# EasyEDA Pro project evenVCO.eprj, board PCB1_2
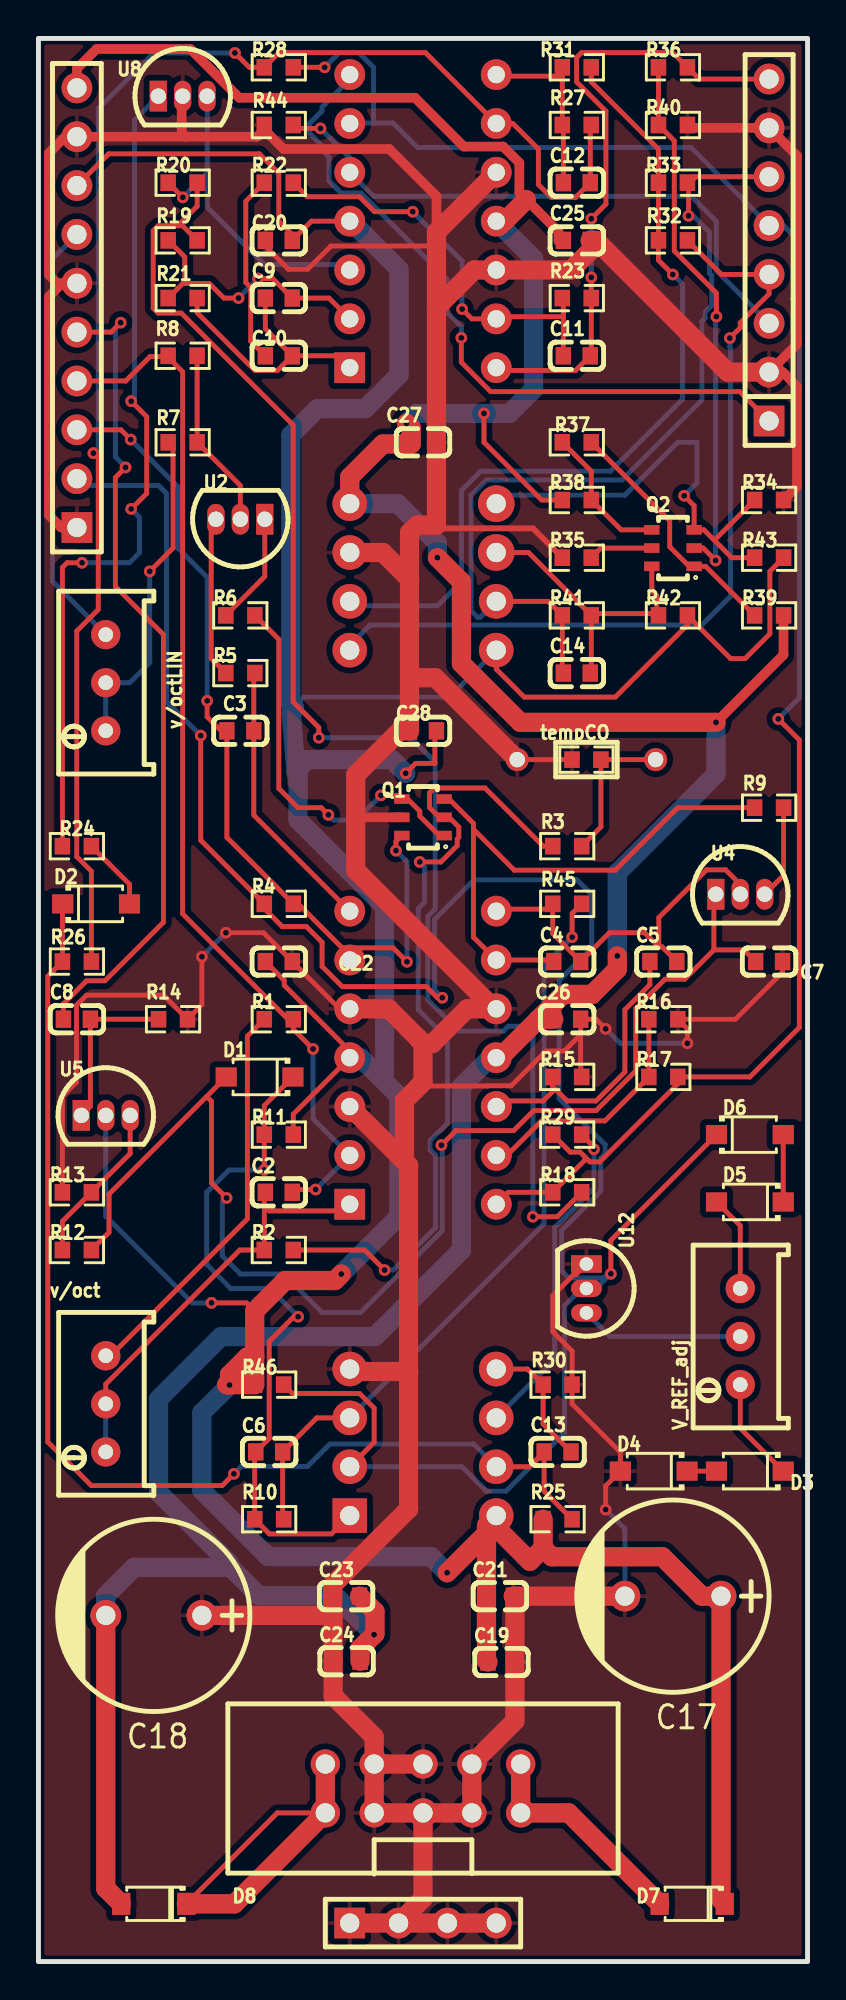
[diagram p4: board, top side]
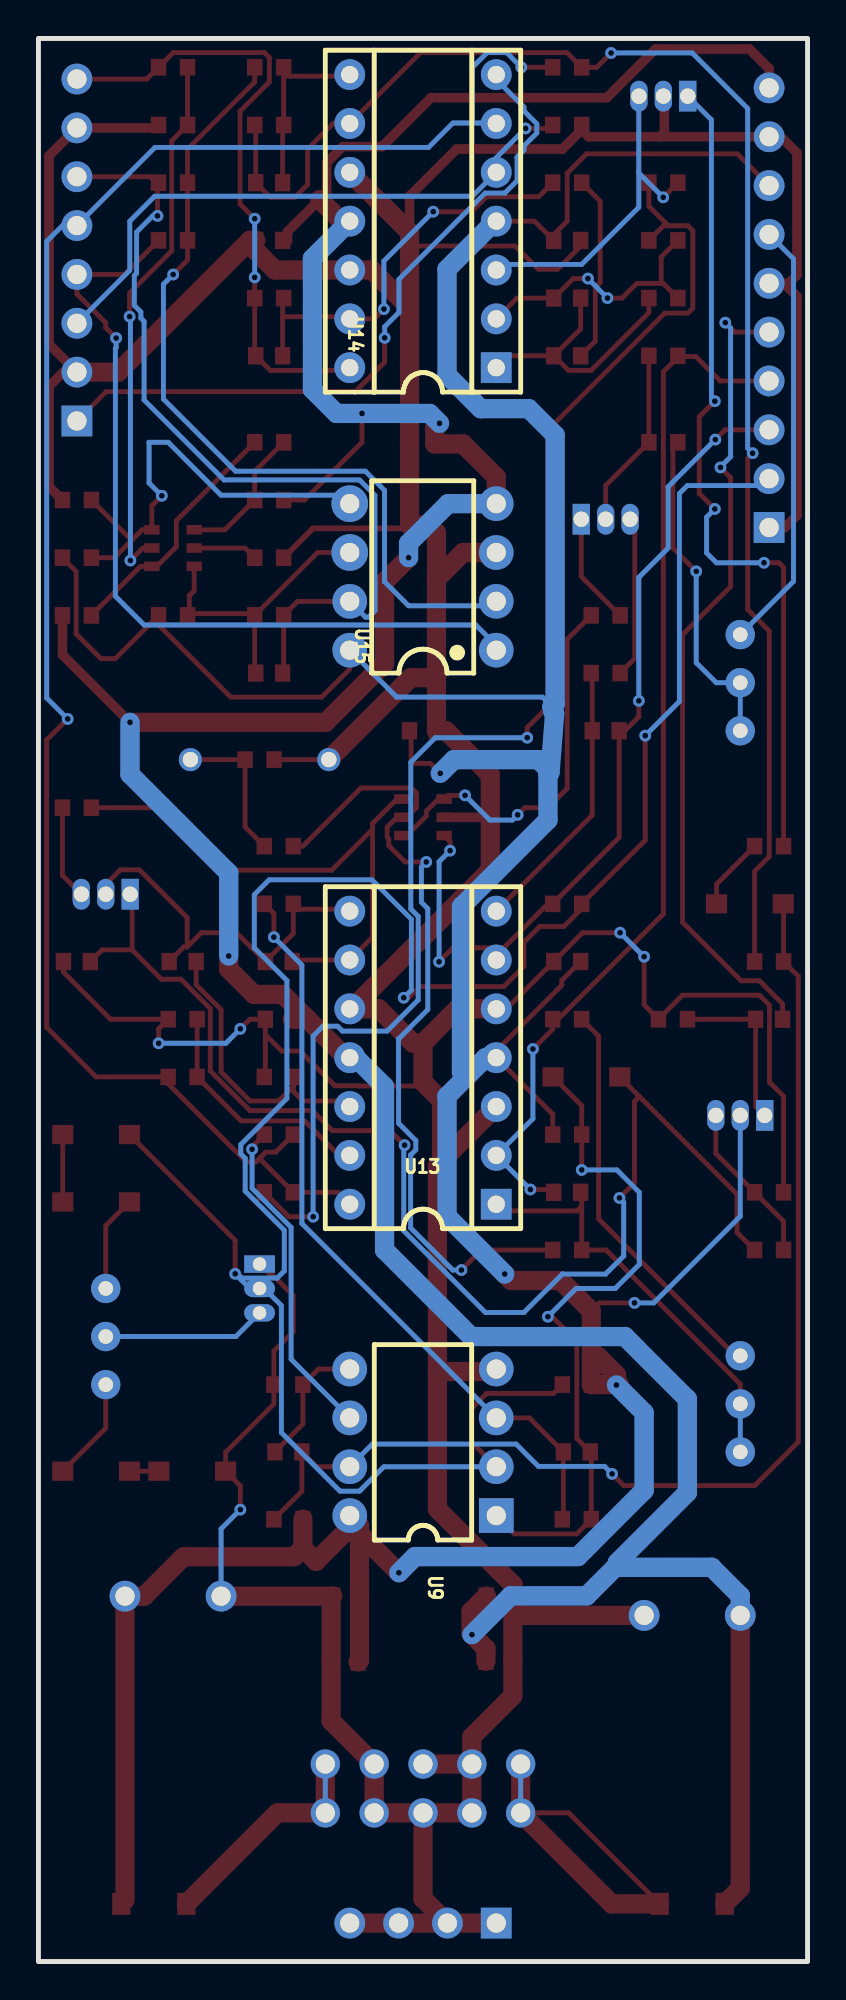
[diagram p5: board, bottom side, seen from below]

Outline 40 x 100 mm; copper layers: Top Layer, Bottom Layer. Coordinates in mm from the lower left corner of the outline.
Outline path: rectangle 0,100 40,0
Stack: Top Layer 0.035mm / Dielectric1 1.51mm FR4 er 4.5 / Bottom Layer 0.035mm

## Design rules (mm)
template: JLCPCB Capability(Two Layers Board)
spacing copperThickness1oz (default): track to track 0.102, other pairs 0.152 to 0.3
spacing copperThickness2oz: track to track 0.203, other pairs 0.152 to 0.3
track width copperThickness1oz (default): min 0.127, default 0.254, max 2.54
track width copperThickness2oz: min 0.203, default 0.254, max 2.54
differential pair differentialPair (default): width min 0.127, default 0.254, max 2.54; gap min 0.152, default 0.152
via viaSize (default): diameter min 0.5, default 0.61, max 10; hole min 0.3, default 0.305, max 6.3

## Placement (name value [footprint] x y rotation side)
C2  10nF  [C0603]  12.5 40 0 top
C3  1nF  [C0603]  10.5 64 180 top
C4  2.2nF styrene  [C0603]  27.5 52 0 top
C5  680nF polyester  [C0603]  32.5 52 0 top
C6  47pF  [C0603]  12 26.5 0 top
C7  47pF  [C0603]  38 52 180 top
C8  1nF  [C0603]  2 49 0 top
C9  3pF  [C0603]  12.5 86.5 180 top
C10  680nF  [C0603]  12.5 83.5 180 top
C11  10pF  [C0603]  28 83.5 0 top
C12  10pF  [C0603]  28 92.5 0 top
C13  10pF  [C0603]  27 26.5 180 top
C14  2.2nF  [C0603]  28 67 0 top
C17  10uF  [CAP-TH_BD10.0-P5.00-D1.0-FD-H16.0]  33 19 180 top
C18  10uF  [CAP-TH_BD10.0-P5.00-D1.0-FD-H16.0]  6 18 180 top
C19  100nF  [C0603]  24.08 15.58 0 top
C20  100nF  [C0603]  12.5 89.5 180 top
C21  100nF  [C0603]  24 19 0 top
C22  100nF  [C0603]  12.5 52 0 top
C23  100nF  [C0603]  16 19 0 top
C24  100nF  [C0603]  16.03 15.62 0 top
C25  100nF  [C0603]  28 89.5 180 top
C26  100nF  [C0603]  27.5 49 180 top
C27  100nF  [C0603]  20 79 180 top
C28  100nF  [C0603]  20 64 180 top
D1  1N4148W  [SOD-123F_L2.7-W1.6-LS3.8-RD]  11.5 46 180 top
D2  1N4148W  [SOD-123F_L2.7-W1.6-LS3.8-RD]  3 55 0 top
D3  1N4148W  [SOD-123F_L2.7-W1.6-LS3.8-RD]  37 25.5 180 top
D4  1N4148W  [SOD-123F_L2.7-W1.6-LS3.8-RD]  32 25.5 180 top
D5  1N4148W  [SOD-123F_L2.7-W1.6-LS3.8-RD]  37 39.5 180 top
D6  1N4148W  [SOD-123F_L2.7-W1.6-LS3.8-RD]  37 43 0 top
D7  1N5817W  [SOD-123_L2.8-W1.8-LS3.7-RD]  34 3 180 top
D8  1N5817W  [SOD-123_L2.8-W1.8-LS3.7-RD]  6 3 180 top
H1  HTSW-110-07-G-S  [HDR-TH_TSW-110-17-F-S-LL]  2 86 90 top
H2  HTSW-108-22-T-S  [HDR-TH_HTSW-108-22-T-S]  38 89 90 top
H3  HTSW-104-18-F-S  [HDR-TH_HTSW-104-25-S-S-LL]  20 2 180 top
P1  power  [IDC-TH_10P-P2.54_C5665]  20 9 0 top
Q1  BCM847DS,115  [SC-74-6_L2.9-W1.5-P0.95-LS2.8-BR]  20 59.5 0 top
Q2  BCM847DS,115  [SC-74-6_L2.9-W1.5-P0.95-LS2.8-BR]  33 73.5 0 top
R1  95.3k  [R0603]  12.5 49 180 top
R2  6.2k  [R0603]  12.5 37 0 top
R3  4.22R  [R0603]  27.5 58 0 top
R4  820k  [R0603]  12.5 55 180 top
R5  1.5k  [R0603]  10.5 67 180 top
R6  1.5k  [R0603]  10.5 70 0 top
R7  510R  [R0603]  7.5 79 0 top
R8  150k  [R0603]  7.5 83.5 180 top
R9  270R  [R0603]  38 60 0 top
R10  330k  [R0603]  12 23 180 top
R11  22k  [R0603]  12.5 43 0 top
R12  22k  [R0603]  2 37 180 top
R13  100k  [R0603]  2 40 0 top
R14  47k  [R0603]  7 49 180 top
R15  2M  [R0603]  27.5 46 0 top
R16  100k  [R0603]  32.5 49 0 top
R17  100k  [R0603]  32.5 46 180 top
R18  10K  [R0603]  27.5 40 180 top
R19  82k  [R0603]  7.5 89.5 0 top
R20  100K  [R0603]  7.5 92.5 0 top
R21  100k  [R0603]  7.5 86.5 0 top
R22  100k  [R0603]  12.5 92.5 180 top
R23  200k  [R0603]  28 86.5 180 top
R24  220k  [R0603]  2 58 180 top
R25  2.2k  [R0603]  27 23 0 top
R26  430k  [R0603]  2 52 0 top
R27  220k  [R0603]  28 95.5 180 top
R28  100k  [R0603]  12.5 98.5 180 top
R29  100k  [R0603]  27.5 43 0 top
R30  100k  [R0603]  27 30 0 top
R31  22k  [R0603]  28 98.5 180 top
R32  10K  [R0603]  33 89.5 0 top
R33  20k  [R0603]  33 92.5 0 top
R34  10K  [R0603]  38 76 180 top
R35  1k  [R0603]  28 73 180 top
R36  22k  [R0603]  33 98.5 0 top
R37  390  [R0603]  28 79 0 top
R38  43k  [R0603]  28 76 0 top
R39  43k  [R0603]  38 70 180 top
R40  1k  [R0603]  33 95.5 180 top
R41  10K  [R0603]  28 70 0 top
R42  10K  [R0603]  33 70 0 top
R43  10K  [R0603]  38 73 180 top
R44  100k  [R0603]  12.5 95.5 0 top
R45  10K  [R0603]  27.5 55 0 top
R46  1k  [R0603]  12 30 180 top
RTemp  10kΩ  [RES-TH_BD1.8-L3.2-P7.20-D0.4]  28.5 62.5 180 top
tempCO  100R_3500ppm  [R0603]  28.5 62.5 180 top
U2  2N3906(ZA)PNP  [TO-92-3_L4.9-W3.7-P1.27-L_RICKY-RS0108S-U]  10.5 75 180 top
U4  2N3904S(ZC)NPN  [TO-92-3_L4.9-W3.7-P1.27-L_RICKY-RS0108S-U]  36.5 55.5 0 top
U5  2N3904S(ZC)NPN  [TO-92-3_L4.9-W3.7-P1.27-L_RICKY-RS0108S-U]  3.5 44 0 top
U8  2N3904S(ZC)NPN  [TO-92-3_L4.9-W3.7-P1.27-L_RICKY-RS0108S-U]  7.5 97 0 top
U9  LM393N  [DIP-8_L9.7-W6.4-P2.54-LS7.6-BL]  20 27 90 bottom
U12  LM336  [TO-92-3_L4.9-W3.7-P1.27-L]  28.5 35 270 top
U13  TL084CN  [DIP-14_L17.8-W10.2-P2.54-BL_3]  20 47 90 bottom
U14  TL084CN  [DIP-14_L17.8-W10.2-P2.54-BL_3]  20 90.5 90 bottom
U15  TL082  [PDIP-8_L9.6-W6.4-P2.54-LS7.6-BL]  20 72 90 bottom
v/oct  10kΩ  [RES-ADJ-TH_3P-L10.0-W10.0-P2.50-L]  3.5 29 90 top
v/octLIN  1kΩ  [RES-ADJ-TH_3P-L10.0-W10.0-P2.50-L]  3.5 66.5 90 top
V_REF_adj  10kΩ  [RES-ADJ-TH_3P-L10.0-W10.0-P2.50-L]  36.5 32.5 90 top

## Footprints (pads in the part's own frame, mm; a bottom-side part is the same pattern mirrored in y, then rotated)
C0603
  rect 0.8x0.9 smd: 1(-0.7,0) 2(0.7,0)
CAP-TH_BD10.0-P5.00-D1.0-FD-H16.0
  round 1.6 hole 1: 1(-2.5,0) 2(2.5,0)
DIP-8_L9.7-W6.4-P2.54-LS7.6-BL
  rect 1.8x1.8 hole 1: 1(-3.81,-3.81)
  round 1.8 hole 1: 2(-1.27,-3.81) 3(1.27,-3.81) 4(3.81,-3.81) 5(3.81,3.81) 6(1.27,3.81) 7(-1.27,3.81) 8(-3.81,3.81)
DIP-14_L17.8-W10.2-P2.54-BL_3
  rect 1.6x1.6 hole 0.9: 1(-7.62,-3.81)
  round 1.6 hole 0.9: 2(-5.08,-3.81) 3(-2.54,-3.81) 4(0,-3.81) 5(2.54,-3.81) 6(5.08,-3.81) 7(7.62,-3.81) 8(7.62,3.81) 9(5.08,3.81) 10(2.54,3.81) 11(0,3.81) 12(-2.54,3.81) 13(-5.08,3.81) 14(-7.62,3.81)
HDR-TH_HTSW-104-25-S-S-LL
  rect 1.6x1.6 hole 1: 1(3.81,0)
  round 1.6 hole 1: 2(1.27,0) 3(-1.27,0) 4(-3.81,0)
HDR-TH_HTSW-108-22-T-S
  rect 1.6x1.6 hole 1: 1(-8.89,0)
  round 1.6 hole 1: 2(-6.35,0) 3(-3.81,0) 4(-1.27,0) 5(1.27,0) 6(3.81,0) 7(6.35,0) 8(8.89,0)
HDR-TH_TSW-110-17-F-S-LL
  rect 1.6x1.6 hole 1: 1(-11.43,0)
  round 1.6 hole 1: 2(-8.89,0) 3(-6.35,0) 4(-3.81,0) 5(-1.27,0) 6(1.27,0) 7(3.81,0) 8(6.35,0) 9(8.89,0) 10(11.43,0)
IDC-TH_10P-P2.54_C5665
  round 1.524 hole 1: 1(-5.08,-1.27) 2(-5.08,1.27) 3(-2.54,-1.27) 4(-2.54,1.27) 5(0,-1.27) 6(0,1.27) 7(2.54,-1.27) 8(2.54,1.27) 9(5.08,-1.27) 10(5.08,1.27)
PDIP-8_L9.6-W6.4-P2.54-LS7.6-BL
  round 1.8 hole 1: 1(-3.81,-3.81) 2(-1.27,-3.81) 3(1.27,-3.81) 4(3.81,-3.81) 7(-1.27,3.81) 8(-3.81,3.81)
  round 1.905 hole 1: 5(3.81,3.81) 6(1.27,3.81)
R0603
  rect 0.806x0.864 smd: 1(-0.753,0) 2(0.753,0)
RES-ADJ-TH_3P-L10.0-W10.0-P2.50-L
  round 1.524 hole 0.762: 1(-2.5,0) 2(0,0) 3(2.5,0)
RES-TH_BD1.8-L3.2-P7.20-D0.4
  round 1.2 hole 0.8: 1(-3.6,0) 2(3.6,0)
SC-74-6_L2.9-W1.5-P0.95-LS2.8-BR
  rect 0.8x0.5 smd: 1(1.1,-0.95) 2(1.1,0) 3(1.1,0.95) 4(-1.1,0.95) 5(-1.1,0) 6(-1.1,-0.95)
SOD-123_L2.8-W1.8-LS3.7-RD
  rect 0.95x1.15 smd: 1(-1.692,0) 2(1.692,0)
SOD-123F_L2.7-W1.6-LS3.8-RD
  rect 1.1x1 smd: 1(-1.735,0) 2(1.735,0)
TO-92-3_L4.9-W3.7-P1.27-L
  rect 0.9x1.6 hole 0.7: 1(-1.27,0)
  oval 0.9x1.6 hole 0.7: 2(0,0) 3(1.27,0)
TO-92-3_L4.9-W3.7-P1.27-L_RICKY-RS0108S-U
  rect 0.9x1.6 hole 0.8: 1(-1.27,0)
  oval 0.9x1.6 hole 0.8: 2(1.27,0) 3(0,0)

## Nets
As in the schematic.

## Via types
v1: diameter 0.61, hole 0.305, Top Layer to Bottom Layer, 63 vias

## Routing (per net, layer and track width the routed paths; a pad name or vN(x,y) marks a point on that pad's centre or on a via; arc(x,y) is an arc through that point)
+12V: length 233.4
  Top Layer w0.254: 11.25,33.82 10.82,34.25 v1(9,34.25) ; C22.1 12.78,51.02 12.78,50.76 16.19,47.36 U13.4 13.25,44.06 R11.2 ; U9.8 23.3,22.68 ; U14.4 14.2,90.5 C20.1 13.2,89.8 12.5,90.5 12.5,92.99 11.49,94 3.65,94 H1.8 ; v1(19.1,61.79) 19.62,62.3 20.62,62.3 20.62,63.92 C28.1 ; R43.1 38.04,72.29 38.04,69.04 36.75,67.75 36,67.75 R42.2 33.75,69.5 30,65.75 25.27,65.75 23.81,67.21 U15.8 ; 35.5,3.19 D7.1
  Top Layer w1: 11.25,31.45 11.25,33.82 12.84,35.41 15.41,35.41 v1(15.75,35.75) ; 11.25,31.45 R46.2 9.94,30 ; 11.25,31.45 10.88,31.45 9.94,30.51 9.94,30.14 ; 9.94,30 9.8,30 9.94,30.14 ; 9.94,30 v1(9.94,29.98) ; 9.94,30 9.94,30.14 ; C19.1 23.3,15.66 C21.1 ; 26.25,21.5 26.7,21.05 32.45,21.05 34.5,19 C17.1 35.5,3.19 ; 26.25,21.5 26.25,21.5 25.56,20.81 23.81,22.56 U9.8 ; 26.25,21.5 R25.1 ; 23.3,22.27 23.3,19 ; 23.3,22.27 v1(21.25,20.22) ; 23.3,22.27 23.3,22.68
  Bottom Layer w0.254: v1(9,34.25) 8,34.25 3.5,38.75 U5.3 ; U15.8 21.37,65.75 13.79,65.75 13.29,65.25 13.25,65.25 13.24,65.24 ; 13.23,65.17 13.06,65 13.24,65 13.24,65.19
  Bottom Layer w1: 17.75,46 18,46.25 18,54.86 13.5,59.36 13.5,61.75 ; 17.75,46 16.75,47 U13.4 ; 17.75,46 18.75,45 18.75,38.75 v1(15.75,35.75) ; v1(21.25,20.22) 20.41,21.06 11.94,21.06 8.5,24.5 8.5,28.54 v1(9.94,29.98) ; 13.5,61.75 13.39,61.84 13.15,64.89 13.24,65 13.23,65.17 13.24,65.19 13.29,65.24 13.29,65.25 13.13,65.39 13.13,79.38 14.5,80.75 17,80.75 18.75,82.5 18.75,88 16.25,90.5 U14.4 ; 13.5,61.75 13.5,62 14,62.5 18.39,62.5 v1(19.1,61.79)
-12V: length 198.6
  Top Layer w0.254: R38.1 26.17,76 23.17,79 v1(23.17,80.5) ; 19.39,78.91 C27.2 ; C25.2 27.05,89.45
  Top Layer w0.5: R39.1 38.75,70 38.75,67.95 v1(35.24,64.44) ; H1.10 2,98.43 3.02,99.45 7.91,99.45 10.44,96.92 19.58,96.92 22.12,94.38 24.17,94.38 25.01,93.54 25.01,91.99 27.05,89.95 27.05,89.45
  Top Layer w1: D8.2 3.5,3.81 C18.2 ; C26.2 26,49 ; 26,49 24,47 U13.11 ; 26,49 27.29,50.29 28.79,50.29 30.11,51.61 v1(30.11,52.29) ; U14.11 24.25,90.5 25.38,91.62 ; U15.4 16.19,77.19 17.91,78.91 19.39,78.91 19.39,79.74 v1(19.14,79.99) ; v1(20.75,73) 22,71.75 22,67.5 25.06,64.44 v1(35.24,64.44) ; C23.2 17.5,18.2 17.5,17.05 v1(17.45,17) 16.73,16.27 C24.2
  Bottom Layer w1: 9.89,20.5 10,20.5 11.48,19.02 15.44,19.02 v1(17.45,17) ; 9.89,20.5 4.98,20.5 3.5,19.02 C18.2 ; 9.89,20.5 9.89,20.75 6.25,24.39 6.25,29.25 9.5,32.5 17.5,32.5 22,37 22,45.5 23.46,46.96 23.82,46.96 ; v1(30.11,52.29) 30.11,56.61 35.24,61.74 v1(35.24,64.44) ; v1(20.75,73) 20.75,73.75 18.69,75.81 U15.4 ; U14.11 25.75,88.56 25.75,81.75 24.5,80.5 v1(23.17,80.5) 19.65,80.5 v1(19.14,79.99)
GND: length 362.7
  Top Layer w0.254: 19.8,45.53 23.35,45.53 23.36,45.54 24.58,45.54 26.39,47.35 27.35,47.35 28.2,48.2 ; 7.75,49 6.5,50.25 2.5,50.25 1.98,49.73 1.98,45.73 1.25,45 R13.1 ; 7.75,49 R14.1 ; 7.75,49 8.5,49.75 v1(8.5,52.25) ; 28.2,48.2 28.2,46.05 R15.2 ; 28.2,48.2 C26.1 29,49 v1(29.5,48.5) ; tempCO.2 RTemp.2 ; v1(33.75,47.75) 33.75,48.5 R16.2 36.25,49 38.7,51.45 C7.1 ; 20.7,89.21 15.21,89.21 14,88 13,88 11.8,89.2 C20.2 ; U12.1 27.96,35.73 27.85,35.73 26.75,34.63 26.75,32.75 27.75,31.75 R30.2 27.75,29 30.26,26.49 D4.2 29.5,24.74 v1(29.5,23.5) ; U13.5 15.66,49.54 C22.2 11.7,53.5 v1(9.75,53.5)
  Top Layer w0.3: 20.7,74.69 20.87,74.52 25.72,74.52 R35.2
  Top Layer w0.5: 7.67,94.89 7.45,95.11 7.45,96.5 7.67,96.72 ; 7.67,94.89 H1.9 1.39,94.89 0.55,94.05 0.55,87.7 0.98,87.27 1.23,87.27 ; 7.67,94.89 11.38,94.89 11.75,95.25 ; R40.1 33.9,95.35 H2.7 39.45,93.9 39.45,84.1 H2.2 38.71,82.65 39.45,81.91 39.45,76.7 R34.1 ; 1.23,87.27 H1.6 ; 1.23,87.27 0.55,86.59 0.55,75.2 1.18,74.57 H1.1 ; Q1.5 16.5,59.5 ; 11.75,95.25 12.75,94.25 18.25,94.25 20.7,91.8 20.7,89.93 ; 11.75,95.25 R44.1
  Top Layer w1: 19.03,41.61 U13.3 ; 19.03,41.61 19.03,44.77 20,45.73 20,47.75 ; 19.03,41.61 19.25,41.4 19.25,30.68 ; U15.3 17.91,73.27 19.3,71.88 ; H2.2 35.85,82.65 29,89.5 C25.1 28.97,89.23 27.7,87.96 U14.12 22.66,87.96 20.7,86 ; 20.7,86 C27.1 20.7,74.69 19.69,74.69 19.3,74.3 19.3,71.88 ; 20.7,86 20.7,89.93 U14.10 ; 20,47.75 19.75,48 19.75,48.01 18.22,49.54 U13.5 ; 20,47.75 20.51,47.75 22.3,49.54 23.71,49.54 ; H3.2 20,3.27 P1.5 ; H3.2 H3.1 ; H3.2 H3.3 H3.4 ; 15.33,18.17 C24.1 15.33,13.82 17.46,11.68 P1.4 ; RTemp.2 20.64,66.76 19.3,66.76 ; 15.3,18.5 C23.1 15.3,19.58 19.25,23.53 19.25,30.68 ; P1.5 P1.7 P1.8 24.78,12.51 C19.2 24.78,18.92 C21.2 C17.2 ; P1.5 P1.3 P1.4 ; 19.25,30.68 16.32,30.68 U9.4 ; 19.3,66.76 19.3,71.88 ; 19.3,66.76 C28.2 18.8,64 16.5,61.7 16.5,56.75 23.71,49.54 ; 23.71,49.54 U13.10 ; 14.8,18 C18.1 ; P1.4 P1.6
  Bottom Layer w0.254: v1(33.75,47.75) 30.25,47.75 v1(29.5,48.5) ; C17.2 30.5,22.5 v1(29.5,23.5) ; v1(9.75,53.5) v1(8.5,52.25)
-V_REF: length 22.5
  Bottom Layer w0.254: H1.7 0.73,88.54 0.73,71.77 v/octLIN.3
EVEN_OUT: length 43.7
  Top Layer w0.254: v1(35.96,84.42) 36.5,84.96 36.5,85.22 38,86.72 H2.4 35.52,87.73 R32.2
  Bottom Layer w0.254: v1(35.96,84.42) 35.96,83.92 36,83.88 36,71 34.5,69.5 17.25,69.5 16.19,68.44 U15.1
FM_IN: length 45.8
  Top Layer w0.254: v1(4.8,79.14) 4.29,79.65 H1.3 ; 15.79,52.71 16.19,52.32 U13.6 ; 15.79,52.71 18.44,52.71 v1(19.17,51.99) ; 15.79,52.71 13.51,55 R4.1 9.8,58.45 C3.2 9.66,63.86 9.64,63.86 8.77,64.73 v1(8.77,65.56) ; v1(18.59,57.77) 18.59,58.24 Q1.6
  Bottom Layer w0.254: v1(19.17,51.99) 19.17,57.19 v1(18.59,57.77) ; v1(4.8,79.14) 7.25,76.69 7.25,73.5 8.77,71.98 v1(8.77,65.56)
PW_IN: length 31
  Top Layer w0.254: R44.2 13.43,95.32 v1(14.67,95.32)
  Bottom Layer w0.254: v1(14.67,95.32) 16.19,93.8 U14.5 17.44,91.79 33.96,91.79 35.25,90.5 35.25,87.94 H2.3
PW_OUT: length 37
  Top Layer w0.254: H2.1 36.48,81.63 23.52,81.63 21.99,83.16 v1(21.99,84.43)
  Bottom Layer w0.254: U14.7 16.19,97.87 14.75,96.43 14.75,96.23 14.08,95.56 14.08,95.08 14.75,94.41 14.75,94.2 15.11,93.83 15.11,92.59 15.74,91.96 16.77,91.96 21.25,87.48 21.25,85.75 21.99,85.01 v1(21.99,84.43)
SAW_OUT: length 97.7
  Top Layer w0.254: 28.43,41.84 28.17,42.09 27.66,42.09 R29.1 ; 28.43,41.84 28.68,41.58 29.19,41.58 33.25,45.65 R17.1 37,46 39.57,48.57 39.57,63.52 v1(38.48,64.62) ; 28.43,41.84 28.43,41.68 R18.2 24.43,40 U13.14 ; v1(14.89,98.5) R28.1
  Bottom Layer w0.254: 17.43,95.6 16.21,95.6 U14.6 ; 17.43,95.6 17.43,98.5 16.66,99.26 15.65,99.26 v1(14.89,98.5) ; 17.43,95.6 18.44,95.6 19.71,94.33 33.94,94.33 H2.5 38.75,90.27 39.57,89.45 39.57,65.71 v1(38.48,64.62)
SIN_OUT: length 45.2
  Top Layer w0.254: H2.6 34.19,92.81 33.94,92.56 33.81,92.56 ; C14.1 27.25,67.05 R41.1 26.52,70.73 U15.7 ; 33.81,92.56 R33.2 ; 33.81,92.56 v1(33.81,90.77)
  Bottom Layer w0.254: U15.7 22.99,69.91 22.83,69.91 22.5,70.24 22.5,76.24 23.3,77.04 30.34,77.04 34.51,81.2 34.51,85.29 34.67,85.46 34.67,85.78 35.02,86.12 35.02,87.67 34.89,87.79 34.89,89.93 34.05,90.77 v1(33.81,90.77)
SYNC: length 43
  Top Layer w0.254: v1(4.53,77.69) 4,77.17 4,71.5 6.5,69 6.5,54.04 3.46,51 2.5,51 1.3,49.8 C8.1 ; H1.5 3.79,84.73 v1(4.28,85.22)
  Bottom Layer w0.254: v1(4.28,85.22) 4,84.94 4,78.25 4.53,77.72 v1(4.53,77.69)
TRI_OUT: length 32.4
  Top Layer w0.254: v1(28.75,87.58) R23.1 28.75,83.55 C11.2 27.94,82.74 23.95,82.74 U14.14 ; H2.8 34.36,97.89 R36.2 32.99,99.26 28.25,99.26 27.99,99.01 27.99,97.74 29.52,96.21 29.52,91.39 v1(28.75,90.63)
  Bottom Layer w0.254: v1(28.75,90.63) v1(28.75,87.58)
V_OCT_IN: length 54.7
  Top Layer w0.254: H1.4 4.54,82.19 5.81,83.46 6.71,83.46 ; 6.71,83.46 R8.2 ; 6.71,83.46 7.5,82.67 7.5,54.48 12.98,49 R1.1 13.25,48.48 v1(14.28,47.45) ; C2.2 13.35,40.15 v1(14.42,40.15)
  Bottom Layer w0.254: v1(14.28,47.45) 14.28,43.83 U13.2 v1(14.42,40.15)
V_REF: length 120.1
  Top Layer w0.254: D6.1 29.77,37.5 v1(29.77,35.76) ; U9.2 17.46,27 17.46,28.78 16.7,29.54 13.21,29.54 R46.1 ; v1(8.44,63.75) 8.44,58.31 R4.2 11.75,54.75 12.67,53.82 13.93,53.82 14.75,53 14.75,51.75 15.8,50.7 20.17,50.7 20.75,50.12 v1(21,50.12)
  Bottom Layer w0.254: v1(21,50.12) 20.61,50.51 20.61,54.2 22.66,56.25 28,56.25 28.77,55.48 28.77,52.71 27.08,51.02 27.08,44.88 29.47,42.48 29.47,42 29.25,41.77 29.25,40.06 27.21,38.03 27.21,35.91 27.58,35.54 29.42,35.54 29.64,35.76 v1(29.77,35.76) 29.01,35 U12.2 28.37,34.87 28.13,34.87 27.37,34.11 27.37,27.51 24.32,24.46 23.3,24.46 22.03,25.73 U9.2 ; v1(8.44,63.75) 6.67,65.52 6.67,76.34 6.25,76.75 2.36,76.75 H1.2
$1N507: length 21.1
  Top Layer w0.254: R1.2 10.87,48.12 10.87,38.62 3.75,31.5 v/oct.3
$1N1389: length 14.5
  Top Layer w0.254: R5.1 11.2,66.95 C3.1 11.2,59.61 U13.7
$1N1507: length 8.4
  Top Layer w0.254: U2.2 8.98,74.75 8.98,67.76 R5.2
$1N1586: length 5.8
  Top Layer w0.254: R6.1 11.77,72.02 U2.1
$1N1640: length 9.4
  Top Layer w0.254: U2.3 10.5,76.75 R7.2 R8.1
$1N1719: length 17.3
  Top Layer w0.254: v1(5.79,72.29) 7,73.5 7,78.75 R7.1
  Bottom Layer w0.254: v/octLIN.1 v/octLIN.2 4.75,66.5 5.79,67.54 v1(5.79,72.29)
$1N2016: length 29.5
  Top Layer w0.254: 22.62,58.88 24.75,56.75 30,56.75 33.25,60 R9.1 ; 22.62,58.88 22.62,53.27 U13.9 26.72,52.08 C4.1 ; 22.62,58.88 22.62,59.18 21.35,60.45 Q1.3
$1N2204: length 4.9
  Top Layer w0.254: U4.2 38.75,56.48 R9.2
$1N2447: length 35.8
  Top Layer w0.254: v1(11.74,41.16) 11.74,43 R11.1 11.75,44.51 D1.1 ; U9.1 15.24,22.24 12.01,22.24 R10.2 11.25,26.45 C6.1 12,27.2 12,32.25 13.28,33.53 v1(13.5,33.53)
  Bottom Layer w0.254: v1(11.74,41.16) 9.91,41.16 8.75,40 8.75,36.25 10,35 12.04,35 v1(13.5,33.53)
$1N2683: length 15
  Top Layer w0.254: U13.12 24.1,44.75 26.25,44.75 26.75,45.25 26.75,45.5 ; 26.75,45.5 R15.1 ; 26.75,45.5 27.5,44.75 29,44.75 30.5,46.25 30.5,49.5 31.8,50.8 C5.1
$1N2690: length 7.8
  Top Layer w0.254: RTemp.1 tempCO.1 29.25,59 R3.2
$1N2936: length 20.3
  Top Layer w0.254: Q1.1 20.85,58.55 19.83,59.57 19.83,59.82 19.2,60.45 Q1.4 18.71,60.64 v1(17.81,60.64) ; v1(15.08,59.63) 14.71,60 13.5,60 12.5,61 12.5,68.75 R6.2
  Bottom Layer w0.254: v1(15.08,59.63) 15.35,59.36 16.53,59.36 v1(17.81,60.64)
$1N2959: length 42.9
  Top Layer w0.254: R3.1 26.25,58 23.23,61.02 20.59,61.02 20.34,60.77 20.34,60.01 20.85,59.5 Q1.2 21.35,59.5 21.86,58.99 21.86,58.46 21.78,58.38 21.78,58.03 20.93,57.18 v1(19.83,57.18) ; R2.2 16.96,37 v1(18,35.96)
  Bottom Layer w0.254: v1(19.83,57.18) 20.08,56.92 20.08,55.08 19.75,54.75 19.75,49.5 21.27,47.98 21.27,45.8 21.27,45.8 21.27,43.59 20.37,42.69 20.37,42.21 20.64,41.94 20.64,38.15 18.45,35.96 v1(18,35.96)
$1N3105: length 65.2
  Top Layer w0.254: 35.13,52.6 33.6,51.08 32.59,51.08 31.06,49.56 31.06,46.31 29,44.25 25.76,44.25 24.71,43.21 21.71,43.21 v1(20.96,42.45) ; 35.13,52.6 35.13,55.4 U4.1 ; 35.13,52.6 36.7,52.6 C7.2 ; 8.75,44.98 3.67,39.9 3.67,37.92 R12.1 ; 8.75,44.98 9,44.73 9,40.49 v1(9.78,39.71) ; 8.75,44.98 D1.2
  Bottom Layer w0.254: v1(20.96,42.45) 21,42.41 21,38 16.75,33.75 14.75,33.75 12.75,35.75 10.5,35.75 9.56,36.69 9.56,39.48 v1(9.78,39.71)
$1N3116: length 20.4
  Top Layer w0.254: C5.2 32.44,52.76 32.26,52.76 ; 32.26,52.76 31.53,53.5 29.7,53.5 C4.2 26.75,53.45 26.75,54.72 ; 32.26,52.76 32.26,54.29 34.75,56.77 35.74,56.77 36.5,56.01 U4.3 ; 26.75,54.72 R45.1 ; 26.75,54.72 23.91,54.72 U13.8
$1N3938: length 8.7
  Top Layer w0.254: R14.2 C8.2 2.7,44.47 U5.1
$1N3981: length 8.5
  Top Layer w0.254: U5.2 4.77,42.02 R13.2 1.25,38.49 R12.2
$1N4358: length 12.6
  Top Layer w0.254: R16.1 R17.2 29.46,43.71 26.16,43.71 24.36,41.92 U13.13
$1N4747: length 17.4
  Top Layer w0.254: R20.1 v1(7.51,91.74)
  Bottom Layer w0.254: U8.2 8.78,96.99 8.78,93.01 ; U14.3 15.9,88.25 11.75,88.25 8.78,91.22 8.78,93.01 ; 8.78,93.01 v1(7.51,91.74)
$1N4955: length 74
  Top Layer w0.254: v1(25.71,38.73) 26.98,38.73 R18.1 ; 7.24,90.26 8.25,91.28 R20.2 ; 7.24,90.26 6.22,90.26 5.97,90.01 5.97,85.97 6.22,85.72 7.43,85.72 13.25,79.9 13.25,65.5 14.58,64.17 v1(14.58,63.64) ; 7.24,90.26 7.49,90.26 R19.2
  Bottom Layer w0.254: v1(14.58,63.64) 19.36,63.64 20.63,62.37 20.63,54.73 20.25,54.35 20.25,50 21.87,48.38 24.19,48.38 24.44,48.64 25.21,48.64 25.71,48.13 v1(25.71,38.73)
$1N5308: length 21.5
  Top Layer w0.254: R23.2 27.3,86.45 27.3,85.53 ; C11.1 27.3,85.53 ; 27.3,85.53 23.92,85.53 U14.13 22.54,85.42 v1(22.03,85.93) ; R22.1 13.98,91.77 16.7,91.77 17.48,90.99 v1(19.47,90.99)
  Bottom Layer w0.254: v1(19.47,90.99) 22.03,88.43 v1(22.03,85.93)
$1N5674: length 44
  Top Layer w0.254: v1(4.82,81.14) 5.63,80.33 5.63,76.34 v1(4.82,75.53) ; R24.2 1.25,72.5 1.49,72.74 v1(2.27,72.74)
  Bottom Layer w0.254: v1(4.82,81.14) 5,81.32 5,95.77 U8.1 ; v1(4.82,75.53) 5.25,75.11 5.25,73.25 4.74,72.74 v1(2.27,72.74)
$1N5714: length 3.8
  Top Layer w0.254: R24.1 4.74,56.02 D2.2
$1N6127: length 39.5
  Top Layer w0.254: R45.2 27.76,54.5 v1(27.76,53.27) ; R10.1 12.7,23.05 C6.2 14.47,28.27 U9.3
  Bottom Layer w0.254: v1(27.76,53.27) 26.3,51.81 26.3,38.38 U9.3
$1N6419: length 17.1
  Top Layer w0.254: v1(28.89,42.24) 28.89,42.36 R29.2
  Bottom Layer w0.254: v1(28.89,42.24) 28.89,40.21 26.86,38.18 26.86,31.32 U9.6
$1N6424: length 6.9
  Top Layer w0.254: U9.5 25.44,30.81 R30.1 26.25,27.95 C13.1
$1N6566: length 60.9
  Top Layer w0.254: v1(10.17,25.36) 9.56,24.75 2.75,24.75 0.48,27.02 0.48,51.24 R26.1 1.25,54.98 D2.1 ; U9.7 25.53,25.73 C13.2 26.3,24.45 R25.2
  Bottom Layer w0.254: U9.7 22.63,26.91 15.16,26.91 14,25.75 10.56,25.75 v1(10.17,25.36)
$1N7314: length 28.3
  Top Layer w0.254: R36.1 R40.2 33.07,94.68 33.07,88.95 35.26,86.77 v1(35.26,85.54) ; Q2.2 34.57,73.5 v1(35.22,72.85)
  Bottom Layer w0.254: v1(35.22,72.85) 35.22,85.5 v1(35.26,85.54)
$1N7370: length 7.4
  Top Layer w0.254: Q2.4 30.3,74.45 R38.2 28.75,77.49 R37.1
$1N7375: length 13
  Top Layer w0.254: R37.2 32.83,74.92 32.83,73.57 33.85,72.55 Q2.1 34.7,72.55 R39.2
$1N8230: length 5.4
  Top Layer w0.254: V_REF_adj.1 36.5,27.74 D3.1
$1N8312: length 8.5
  Bottom Layer w0.254: U12.3 29.73,32.5 V_REF_adj.2
$1N8440: length 1.5
  Top Layer w0.254: D3.2 D4.1
$1N8647: length 3.5
  Top Layer w0.254: D5.1 D6.2
$1N8687: length 5
  Top Layer w0.254: D5.2 36.5,38.27 V_REF_adj.3
$1N9074: length 23.5
  Top Layer w0.254: D8.1 12.42,7.73 P1.1
  Top Layer w1: P1.2 P1.1 10.19,3 D8.1
  Bottom Layer w0.254: P1.1 P1.2
$1N9101: length 14.3
  Top Layer w1: P1.10 P1.9 27.58,7.73 D7.2
  Bottom Layer w0.254: P1.9 P1.10
$1N9891: length 22.4
  Top Layer w0.254: C2.1 11.75,39.95 11.75,39.29 ; 11.75,39.29 12,39.03 15.84,39.03 U13.1 ; 11.75,39.29 R2.1 10.47,37 3.5,30.03 v/oct.2
  Bottom Layer w0.254: v/oct.2 v/oct.1
$1N10311: length 14.1
  Top Layer w0.254: C10.1 15.57,83.5 U14.1 ; C10.1 12.44,82.74 11.25,82.74 8.25,85.74 R21.2 ; C10.1 11.8,84.9 C9.2
$1N10325: length 14
  Top Layer w0.254: U14.2 15.11,86.5 C9.1 12.18,87.52 v1(11.42,87.52) ; v1(10.41,86.5) 9.64,86.5 8.88,87.26 7.61,87.26 ; 7.61,87.26 7.51,87.26 R21.1 ; 7.61,87.26 7.61,88.63 R19.1
  Bottom Layer w0.254: v1(11.42,87.52) v1(10.41,86.5)
$1N10403: length 80.3
  Top Layer w0.254: v1(2.86,78.43) 3.11,78.18 3.11,70.31 1.99,69.19 1.99,57.46 2.75,56.69 R26.2 ; R27.1 28.7,95.45 C12.2 27.94,91.74 26.67,91.74 26,92.41 26,94.25 24.67,95.58 U14.9 20.13,99.26 12.51,99.26 R28.2 10.96,98.5 v1(10.22,99.25)
  Bottom Layer w0.254: v1(10.22,99.25) 6,99.25 3.11,96.36 3.11,78.69 v1(2.86,78.43)
$1N10523: length 9.8
  Top Layer w0.254: R22.2 10.78,91.54 10.78,87.31 11.04,87.06 11.04,84.26 C10.2
$1N10728: length 23.5
  Top Layer w0.254: 35.12,73.94 36.06,73 R43.2 ; 35.12,73.94 34.61,74.45 Q2.3 34.1,75.7 v1(33.58,76.22) ; 35.12,73.94 35.19,73.94 R34.2
  Bottom Layer w0.254: U15.5 24.25,76.25 30.5,76.25 33.25,79 34.25,79 34.25,76.89 v1(33.58,76.22)
$1N10768: length 15.5
  Top Layer w0.254: R41.2 28.75,67.05 C14.2 ; R41.2 28.85,70.09 32.15,70.09 ; R41.2 25.48,73.27 U15.6 ; Q2.6 31.9,71.28 32.15,71.03 32.15,70.09 ; 32.15,70.09 R42.1
$1N10882: length 43.9
  Top Layer w0.254: R31.1 28.75,97.74 32.25,94.24 R33.1 R32.1 32.25,88.47 v1(32.99,87.73)
  Bottom Layer w0.254: v1(32.99,87.73) 33.5,87.22 33.5,81.25 29.75,77.5 23,77.5 22,76.5 22,71.75 20.75,70.5 16.42,70.5 U15.2
$1N10889: length 9.5
  Top Layer w0.254: 27.25,98.04 23.89,98.04 U14.8 ; 27.25,98.04 R31.2 ; 27.25,98.04 R27.2 27.3,95.45 C12.1
$1N11135: length 3.4
  Top Layer w0.254: Q2.5 29.25,73.5 R35.1

## Copper pours and planes (outline as drawn; the poured copper is in the pictures)
GND on Top Layer: 0,100 40,100 40,0 0,0
